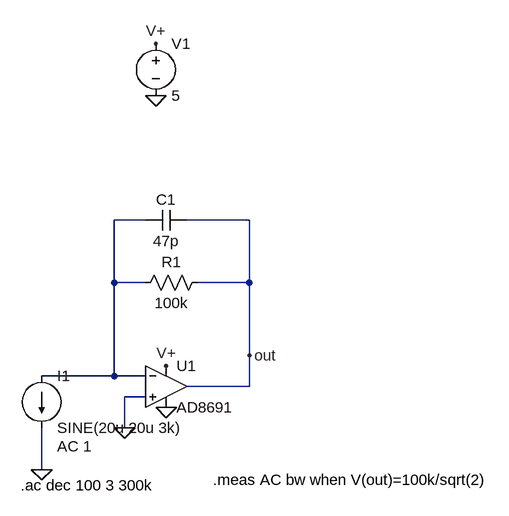
[diagram p0: schematic transimpedance.asc]
transimpedance.asc, the LTspice schematic file:
Version 4
SHEET 1 880 680
WIRE 160 -48 112 -48
WIRE 320 -48 224 -48
WIRE 112 48 112 -48
WIRE 160 48 112 48
WIRE 320 48 320 -48
WIRE 320 48 240 48
WIRE 320 160 320 48
WIRE 112 192 112 48
WIRE 112 192 0 192
WIRE 160 192 112 192
WIRE 320 208 320 160
WIRE 320 208 224 208
WIRE 160 224 128 224
WIRE 128 272 128 224
WIRE 0 336 0 272
FLAG 192 176 V+
FLAG 192 240 0
FLAG 128 272 0
FLAG 0 336 0
FLAG 176 -320 V+
FLAG 176 -240 0
FLAG 320 160 out
SYMBOL OpAmps\\AD8691 192 144 R0
SYMATTR InstName U1
SYMBOL current 0 192 R0
WINDOW 123 24 108 Left 2
WINDOW 39 0 0 Left 0
SYMATTR Value2 AC 1
SYMATTR InstName I1
SYMATTR Value SINE(20u 20u 3k)
SYMBOL res 256 32 R90
WINDOW 0 0 56 VBottom 2
WINDOW 3 32 56 VTop 2
SYMATTR InstName R1
SYMATTR Value 100k
SYMBOL voltage 176 -336 R0
WINDOW 123 0 0 Left 0
WINDOW 39 0 0 Left 0
SYMATTR InstName V1
SYMATTR Value 5
SYMBOL cap 224 -64 R90
WINDOW 0 0 32 VBottom 2
WINDOW 3 32 32 VTop 2
SYMATTR InstName C1
SYMATTR Value 47p
TEXT -32 360 Left 2 !.ac dec 100 3 300k
TEXT 264 352 Left 2 !.meas AC bw when V(out)=100k/sqrt(2)

The netlist it stands for:
* transimpedance.asc
XU1 0 N001 V+ 0 out AD8691  ; pins In+ In- V+ V- OUT
I1 N001 0 SINE(20u 20u 3k) AC 1
R1 out N001 100k
V1 V+ 0 5
C1 out N001 47p
.ac dec 100 3 300k
.meas AC bw when V(out)=100k/sqrt(2)
.backanno
.end